# EAGLE design DAC Breakout Board5 (EAGLE 9.6.2)
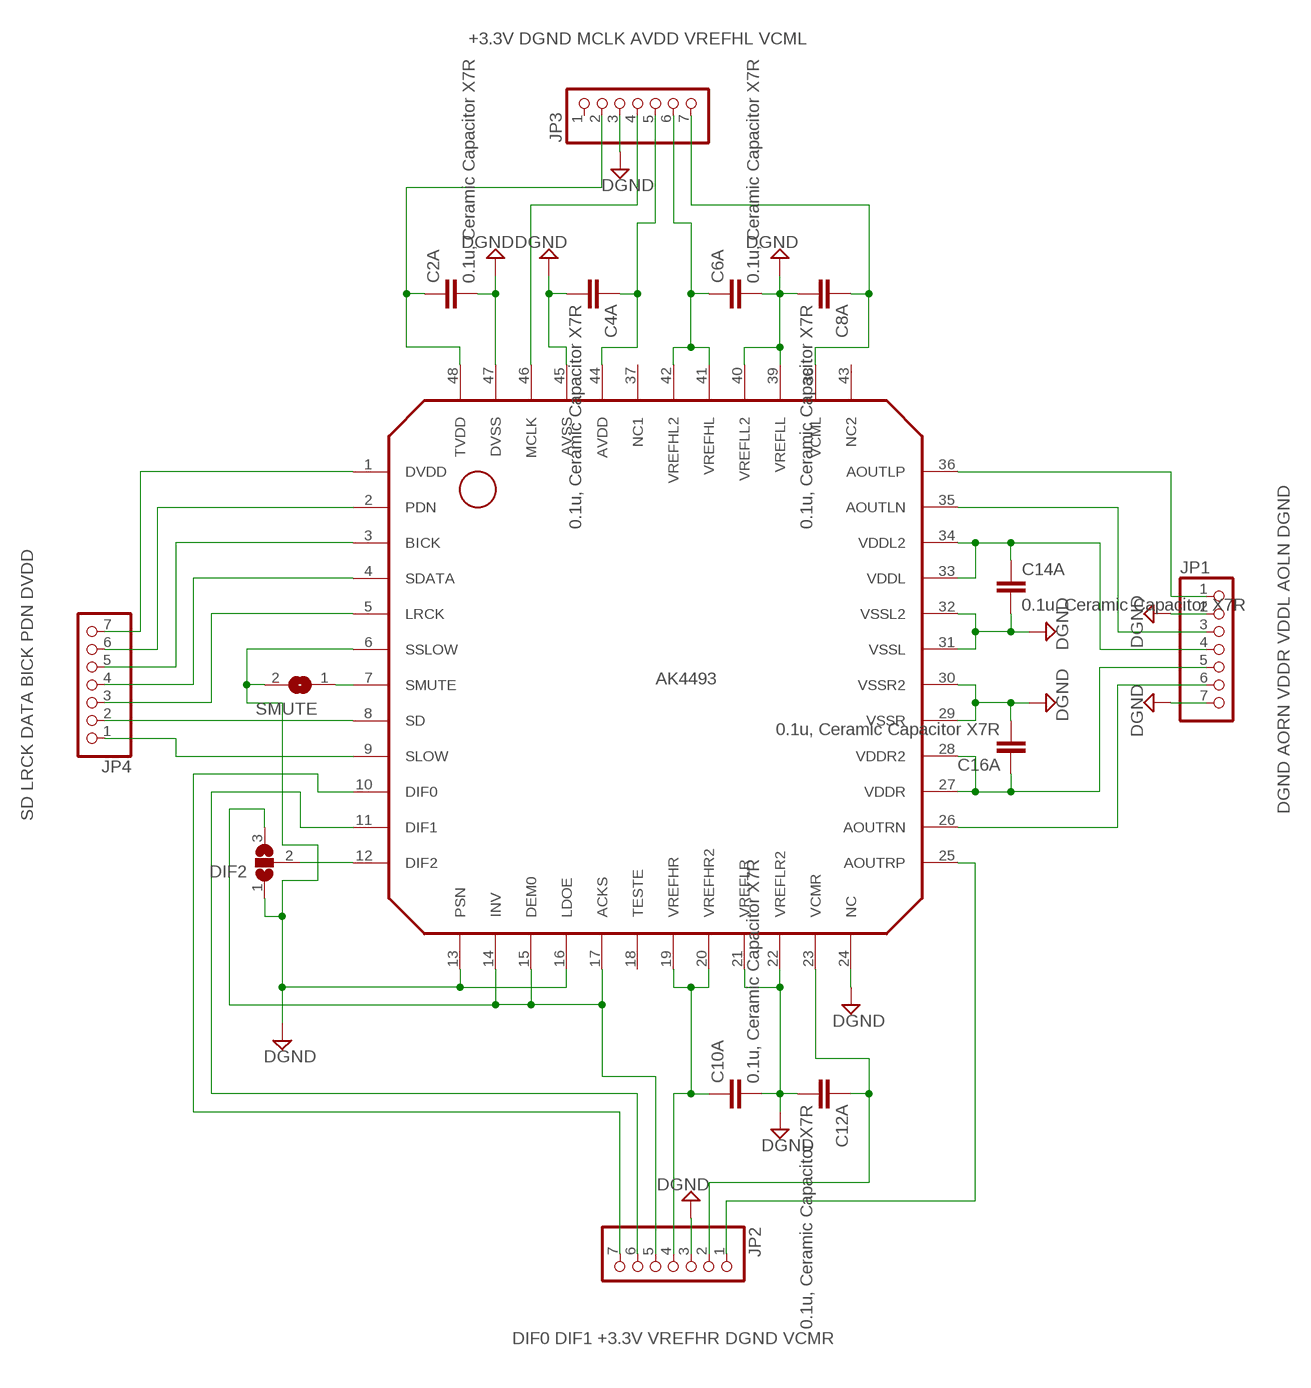
[diagram p0: schematic, sheet 1]

## Parts
C2A  0.1u, Ceramic Capacitor X7R  C-EUC0201  [C0201]
C4A  0.1u, Ceramic Capacitor X7R  C-EUC0201  [C0201]
C6A  0.1u, Ceramic Capacitor X7R  C-EUC0201  [C0201]
C8A  0.1u, Ceramic Capacitor X7R  C-EUC0201  [C0201]
C10A  0.1u, Ceramic Capacitor X7R  C-EUC0201  [C0201]
C12A  0.1u, Ceramic Capacitor X7R  C-EUC0201  [C0201]
C14A  0.1u, Ceramic Capacitor X7R  C-EUC0201  [C0201]
C16A  0.1u, Ceramic Capacitor X7R  C-EUC0201  [C0201]
DIF2  SJ2W  [SJ_2]
IC1  AK4493  [LQFP48]
JP1  PINHD-1X7  [1X07]
JP2  PINHD-1X7  [1X07]
JP3  PINHD-1X7  [1X07]
JP4  PINHD-1X7  [1X07]
SMUTE  SJ  [SJ]

## Nets
DGND: C2A.2 C4A.2 C6A.2 C8A.2 C10A.2 C12A.2 C14A.2 C16A.2 DIF2.1 IC1.6(SSLOW) IC1.13(PSN) IC1.16(LDOE) IC1.21(VREFLR) IC1.22(VREFLR2) IC1.24(NC) IC1.29(VSSR) IC1.30(VSSR2) IC1.31(VSSL) IC1.32(VSSL2) IC1.39(VREFLL) IC1.40(VREFLL2) IC1.45(AVSS) IC1.47(DVSS) JP1.2 JP1.7 JP2.3 JP3.3 SMUTE.2
N$1 [L_Audio]: IC1.36(AOUTLP) JP1.1
N$2 [L_Audio]: IC1.35(AOUTLN) JP1.3
N$3 [R_Audio]: IC1.25(AOUTRP) JP2.1
N$4 [R_Audio]: IC1.26(AOUTRN) JP1.6
N$5: IC1.11(DIF1) JP2.6
N$6: IC1.9(SLOW) JP4.1
N$7: C10A.1 IC1.19(VREFHR) IC1.20(VREFHR2) JP2.4
N$8: IC1.10(DIF0) JP2.7
N$9: IC1.5(LRCK) JP4.3
N$10: IC1.4(SDATA) JP4.4
N$11: IC1.3(BICK) JP4.5
N$12: IC1.46(MCLK) JP3.4
N$13: IC1.1(DVDD) JP4.7
N$14: C4A.1 IC1.44(AVDD) JP3.5
N$15: IC1.2(PDN) JP4.6
N$16: C8A.1 IC1.38(VCML) JP3.7
N$17: C12A.1 IC1.23(VCMR) JP2.2
N$18: C6A.1 IC1.41(VREFHL) IC1.42(VREFHL2) JP3.6
N$19: IC1.7(SMUTE) SMUTE.1
N$20: IC1.8(SD) JP4.2
N$21: DIF2.2 IC1.12(DIF2)
N$22: C14A.1 IC1.33(VDDL) IC1.34(VDDL2) JP1.4
N$23: C16A.1 IC1.27(VDDR) IC1.28(VDDR2) JP1.5
N$25: C2A.1 IC1.48(TVDD) JP3.2
N$26: DIF2.3 IC1.14(INV) IC1.15(DEM0) IC1.17(ACKS) JP2.5
Unconnected: IC1.18(TESTE) IC1.37(NC1) IC1.43(NC2) JP3.1

## Notes on the sheet
- +3.3V DGND MCLK AVDD VREFHL VCML
- DGND AORN VDDR VDDL AOLN DGND
- SD LRCK DATA BICK PDN DVDD
- DIF0 DIF1 +3.3V VREFHR DGND VCMR

## Library data of the parts
C2A C4A C6A C8A C10A C12A C14A C16A = rcl:C-EU: CAPACITOR, European symbol; SPICEPREFIX: C
DIF2 = jumper:SJ2W: SMD solder JUMPER
IC1 = akm:AK4493: Quality Oriented 32-Bit 2ch DAC 32-Bit, 768 kHz with VELVET SOUND
JP1-JP4 = pinhead:PINHD-1X7: PIN HEADER
SMUTE = jumper:SJ: SMD solder JUMPER

## Board
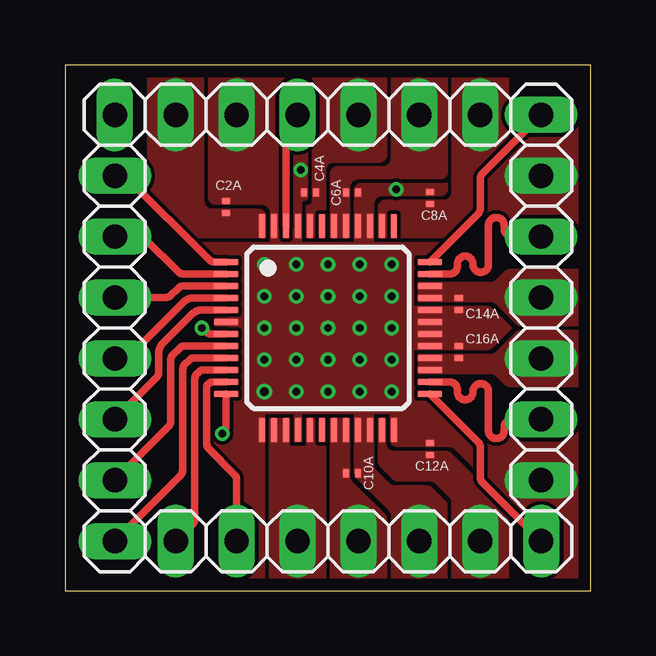
[diagram p1: board, top side]
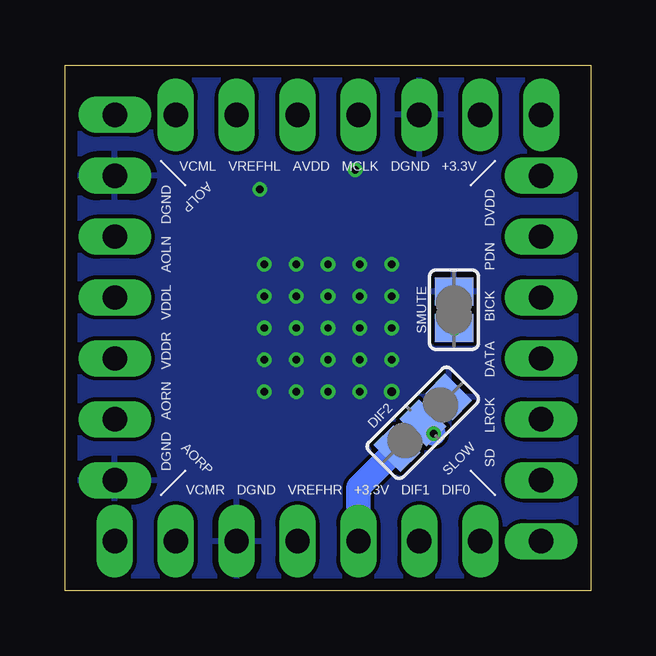
[diagram p2: board, bottom side, seen from below]

Size 21.91 x 21.91 mm. Coordinates in mm from the lower left corner, seen from the top.
Outline: 0,21.91 0,0 21.91,0 21.91,21.91 0,21.91
Copper layers (1*16): Top 0.035mm / dielectric 1.6mm / Bottom 0.035mm
Design rules "Elecrow_2-layer_PCB_eagle_rule": minimum track width 6mil, minimum drill 12mil, track to track 6mil, track to pad 6mil, pad to pad 6mil, via to via 8mil, smd to smd 0mil, copper to edge 20mil, drill to drill 10mil, minimum pad ring 6mil, minimum via ring 6mil, stop-mask expansion 0mil, vias tented up to drill 100mil, thermal gap 10mil

### Footprints (pad centres in the part's own frame; a part is rotated, then mirrored left to right if it is on the bottom)
C0201 = smd 0.25 x 0.35: 1 -0.25,0; 2 0.25,0
SJ_2 = smd 1.168 x 1.6: 1 -1.524,0; 2 0,0; 3 1.524,0
LQFP48 = smd 0.25 x 1: 1 -2.75,-4.25; 2 -2.25,-4.25; 3 -1.75,-4.25; 4 -1.25,-4.25; 5 -0.75,-4.25; 6 -0.25,-4.25; 7 0.25,-4.25; 8 0.75,-4.25; 9 1.25,-4.25; 10 1.75,-4.25; 11 2.25,-4.25; 12 2.75,-4.25; 25 2.75,4.25; 26 2.25,4.25; 27 1.75,4.25; 28 1.25,4.25; 29 0.75,4.25; 30 0.25,4.25; 31 -0.25,4.25; 32 -0.75,4.25; 33 -1.25,4.25; 34 -1.75,4.25; 35 -2.25,4.25; 36 -2.75,4.25 | smd 1 x 0.25: 13 4.25,-2.75; 14 4.25,-2.25; 15 4.25,-1.75; 16 4.25,-1.25; 17 4.25,-0.75; 18 4.25,-0.25; 19 4.25,0.25; 20 4.25,0.75; 21 4.25,1.25; 22 4.25,1.75; 23 4.25,2.25; 24 4.25,2.75; 37 -4.25,2.75; 38 -4.25,2.25; 39 -4.25,1.75; 40 -4.25,1.25; 41 -4.25,0.75; 42 -4.25,0.25; 43 -4.25,-0.25; 44 -4.25,-0.75; 45 -4.25,-1.25; 46 -4.25,-1.75; 47 -4.25,-2.25; 48 -4.25,-2.75
1X07 = drill 1.016 long: 1 -7.62,0; 2 -5.08,0; 3 -2.54,0; 4 0,0; 5 2.54,0; 6 5.08,0; 7 7.62,0
SJ = smd 1.168 x 1.6: 1 -0.762,0; 2 0.762,0

### Placement (x,y rotation side)
C2A  6.71,16 90 top
C4A  10.21,16.6 180 top
C6A  11.96,16.6 0 top
C8A  15.21,16.38 90 top
C10A  11.96,4.9 0 top
C12A  15.21,5.91 90 top
C14A  16.4,11.96 270 top
C16A  16.4,9.96 90 top
DIF2  7,7 225 bottom
IC1  10.96,10.96 270 top
JP1  19.84,12.22 270 top
JP2  12.22,2.06 180 top
JP3  9.69,19.84 0 top
JP4  2.06,9.69 90 top
SMUTE  5.7,11.72 90 bottom

### Tracks (layer width: path | path; a pad name or v marks a point on that pad's centre or on a via)
DGND  (via drill 0.3, 0.35)
  other vias: 9.63,10.96 8.3,10.96 12.28,10.96 13.61,10.96 10.96,10.96 9.63,13.61 8.3,13.61 12.28,13.61 13.61,13.61 10.96,13.61 9.63,12.28 8.3,12.28 12.28,12.28 13.61,12.28 10.96,12.28 9.63,9.63 12.28,9.63 13.61,9.63 10.96,9.63 12.28,8.3 13.61,8.3 10.96,8.3 9.82,17.54 13.8,16.73 9.63,8.3 8.3,9.63 8.3,8.3
  pour Top (rank 6, no thermals): 0,21.91 21.91,21.91 21.91,0 0,0
  pour Bottom: 0,21.91 21.91,21.91 21.91,0 0,0
  pour Top (no thermals): 15.96,17 12.36,17 arc90 12.03,16.68 12.03,14.71 12.88,14.71 12.88,16.13 arc-90 13.2,16.45 15.63,16.45 arc90 15.96,16.78
  cutout Top (no thermals): 4.4,11.71 4.4,10.21 6.2,10.21 6.2,11.71
  pour Top (no thermals): 9.53,8.05 9.53,6.2 9.88,6.2 9.88,8.05 9.95,8.1 9.5,8.1
N$1
  Top 0.305: IC1.36 17.21,15.71 arc45 17.3,15.94 17.3,17.17 arc-45 17.4,17.4 JP1.1
N$2
  Top 0.305: IC1.35 16.02,13.21 arc90 16.35,13.53 16.35,13.62 arc-180 17,13.62 17,13.6 arc180 17.65,13.6 17.65,15.24 arc-180 18.3,15.24 18.3,15.09 arc90 18.62,14.77 JP1.3
N$3
  Top 0.305: JP2.1 17.4,4.51 arc-45 17.3,4.74 17.3,5.97 arc45 17.21,6.2 IC1.25
N$4
  Top 0.305: IC1.26 16.02,8.71 arc-90 16.35,8.38 16.35,8.29 arc180 17,8.29 17,8.31 arc-180 17.65,8.31 17.65,6.67 arc180 18.3,6.67 18.3,6.82 arc-90 18.62,7.14 JP1.6
N$5
  Top 0.305: JP2.6 7.14,4.62 arc45 7.05,4.85 6,5.91 arc-45 5.9,6.13 5.9,8.48 arc-45 5.95,8.61 arc-45 6.18,8.71 IC1.11
N$6
  Top 0.305: IC1.9 5.38,9.71 arc45 5.16,9.61 5,9.45 arc45 4.9,9.22 4.9,5.04 arc-45 4.8,4.8 JP4.1
N$7
  pour Top (no thermals): 11.03,7.2 11.03,0 13.42,0 13.42,2.97 arc45 13.32,3.2 11.97,4.54 arc-45 11.88,4.77 11.88,7.2
N$8
  Top 0.305: JP2.7 5.3,2.77 arc45 5.4,3 5.4,8.82 arc-45 5.5,9.05 5.55,9.11 arc-45 5.78,9.21 IC1.10
N$9
  Top 0.305: IC1.5 5.69,11.71 arc45 5.29,11.54 4.07,10.32 arc45 3.9,9.91 3.9,9.12 arc-45 3.81,8.88 JP4.3
N$10
  Top 0.305: IC1.4 5.34,12.21 arc45 4.94,12.04 2.68,9.78 arc-45 2.45,9.69 JP4.4
N$11
  Top 0.305: IC1.3 4.93,12.71 arc45 4.7,12.61 4.41,12.32 arc-45 4.18,12.22 JP4.5
N$12
  Top 0.305: IC1.46 9.21,19.23 arc-45 9.3,19.46 JP3.4
N$13
  Top 0.305: IC1.1 6.23,13.71 arc-45 6,13.8 2.59,17.21 arc45 2.36,17.3 JP4.7
N$14
  pour Top (no thermals): 10.28,21.91 10.28,16.23 arc-90 10.16,16.1 arc90 10.03,15.97 10.03,14.71 10.88,14.71 10.88,17.53 arc-90 11.2,17.85 13.09,17.85 arc90 13.42,18.18 13.42,21.91
N$15
  Top 0.305: IC1.2 4.93,13.21 arc-45 4.7,13.3 3.33,14.67 arc45 3.1,14.77 JP4.6
N$16
  pour Top (no thermals): 18.5,21.91 18.5,17 16.21,14.71 13.03,14.71 13.03,15.97 arc-90 13.36,16.3 15.79,16.3 arc90 16.11,16.62 16.11,21.91
N$17
  pour Top (no thermals): 16.11,0 18.5,0 18.5,3.19 arc45 18.4,3.42 16.1,5.72 arc49 15.85,5.83 13.7,5.83 arc-90 13.38,6.16 13.38,7.2 13.03,7.2 13.03,5.41 arc45 13.13,5.18 13.66,4.65 arc45 13.89,4.55 15.23,4.55 arc-45 15.46,4.45 16.02,3.9 arc-45 16.11,3.67
N$18
  pour Top (no thermals): 15.96,21.91 15.96,17.48 arc-90 15.63,17.15 12.2,17.15 arc90 11.88,16.83 11.88,14.71 11.03,14.71 11.03,17.38 arc-90 11.36,17.7 13.25,17.7 arc90 13.57,18.03 13.57,21.91
N$19  (via drill 0.3)
  Top 0.305: IC1.7 6.08,10.71 arc-45 5.86,10.8 SMUTE.1
  other vias: 5.7,10.96
N$20
  Top 0.305: IC1.8 4.99,10.21 arc45 4.76,10.11 4.5,9.85 arc45 4.4,9.62 4.4,7.08 arc-45 4.3,6.84 JP4.2
N$21  (via drill 0.3)
  Top 0.305: IC1.12 6.71,6.84 arc-45 6.61,6.61 v6.55,6.55
  Bottom 1.016: DIF2.2 v6.55,6.55
N$22
  pour Top (no thermals): 14.71,12.88 14.71,12.03 17.74,12.03 arc-45 17.97,11.94 18.78,11.13 arc45 19.01,11.03 21.91,11.03 21.91,13.42 18.55,13.42 arc45 18.32,13.32 17.97,12.97 arc-45 17.74,12.88
N$23
  pour Top (no thermals): 14.71,9.03 17.74,9.03 arc-45 17.97,8.94 18.32,8.59 arc45 18.55,8.49 21.91,8.49 21.91,10.88 19.01,10.88 arc45 18.78,10.78 17.97,9.97 arc-45 17.74,9.88 14.71,9.88
N$25
  pour Top (no thermals): 3.41,21.91 3.41,16.39 5.09,14.71 8.38,14.71 8.38,15.6 arc90 8.05,15.92 6.12,15.92 arc-90 5.8,16.25 5.8,21.91
N$26
  Bottom 1.016: JP2.5 9.69,4.32 DIF2.3
  pour Top (rank 2, no thermals): 8.49,0 10.88,0 10.88,7.2 8.49,7.2

### Text on the board
bNames: VCML VREFHL AVDD MCLK DGND +3.3V | AOLP | SD LRCK DATA BICK PDN DVDD | DGND AORN VDDR VDDL AOLN DGND | SLOW | AORP | VCMR DGND VREFHR +3.3V DIF1 DIF0